# Altium project ExtendrjPcb.PrjPcb
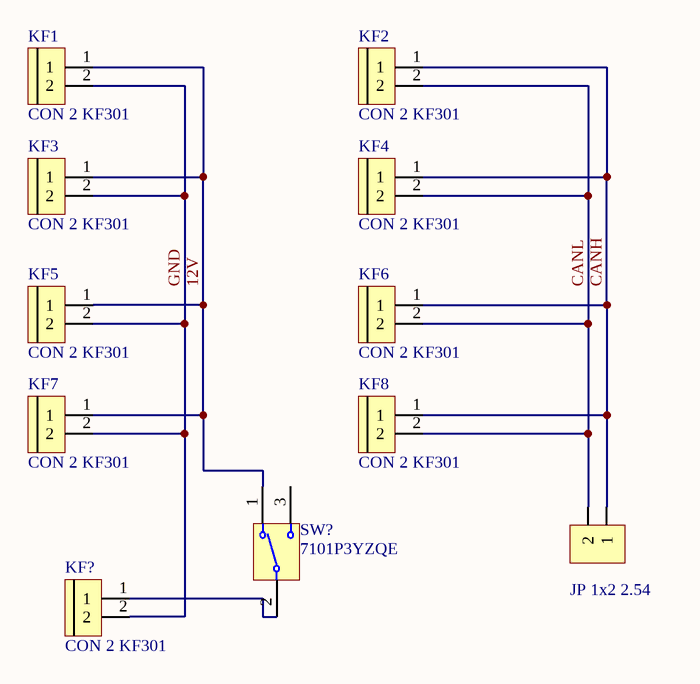
[diagram p0: Sheet2.SchDoc]
1 sheet, 11 parts. Net scope: global (net labels, ports and power ports of the same name join across sheets).
Board file: PCB2.PcbDoc

## Sheet Sheet2.SchDoc
size A; SheetNumber: 1; SheetTotal: 1

### Parts
JP1  JP 1x2 2.54  [JP 1x2 DT]
KF1  CON 2 KF301  [Con 2 KF301 5.08]
KF2  CON 2 KF301  [Con 2 KF301 5.08]
KF3  CON 2 KF301  [Con 2 KF301 5.08]
KF4  CON 2 KF301  [Con 2 KF301 5.08]
KF5  CON 2 KF301  [Con 2 KF301 5.08]
KF6  CON 2 KF301  [Con 2 KF301 5.08]
KF7  CON 2 KF301  [Con 2 KF301 5.08]
KF8  CON 2 KF301  [Con 2 KF301 5.08]
KF?  CON 2 KF301  [Con 2 KF301 5.08]
SW?  7101P3YZQE  [SW_TOGGLE_7101P3YZQE]

### Nets
12V: KF1.1 KF3.1 KF5.1 KF7.1 SW?.1(NC)
CANH: JP1.1 KF2.1 KF4.1 KF6.1 KF8.1
CANL: JP1.2 KF2.2 KF4.2 KF6.2 KF8.2
GND: KF1.2 KF3.2 KF5.2 KF7.2 KF?.2
NetKF?_1: KF?.1 SW?.2(COM)

Not connected (* = marked no-connect by the designer): SW? 3(NO)

### Library data of the parts
JP1 = JP 1x2 2.54 Duc Thang: Cắm; Ten_Linh_Kien: Jump Đơn Đực 2.54MM 1x40P Thẳng 11MM; Don_Vi: Con; Ma_Hang: MH000903; Ghi_Chu: *; Kieu_Chan: *; Chung_Loai: Cắm
KF1-KF8 KF? = CON 2 KF301: Cắm; Ma_Hang: MH000987; Ten_Linh_Kien: CON 2 KF301-2P 5.08MM Xanh Dương; Chung_Loai: Cắm; Ghi_Chu: *; Kieu_Chan: *; Don_Vi: Con
SW? = SW_TOGGLE_7101P3YZQE: SWITCH TOGGLE SPDT 5A 120V; Manufacturer: C&K; Switch Function: On-On; Current Rating: 5A (AC/DC); Voltage Rating - DC: 28V; Actuator Type: Flat Anti-Rotation; Actuator Length: 11.43mm; Illumination: Non-Illuminated; Actuator Material: Brass, Chrome Plated; Electrical Life: 100,000 Cycles; Supplier 1: Digi-Key; Manufacturer Part Number: 7101P3YZQE; RoHS: RoHS Compliant; Category: Switches; Stock 1: 933; Pricing 1: 1=6.11, 10=5.801, 25=5.648, 50=5.4954, 100=5.3428, 250=5.03744, 500=4.2742, 1000=4.04523 (USD); Packaging: Bulk; Part Status: Active; Circuit: SPDT; Voltage Rating - AC: 120V; Illumination Type, Color: -; Illumination Voltage (Nominal): -; Mounting Type: Panel Mount; Termination Style: Solder Lug; Panel Cutout Dimensions: Circular - 6.35mm Dia; Bushing Thread: 1/4-40; Ingress Protection: -; Features: Epoxy Sealed Terminals; Operating Temperature: -30°C ~ 85°C; ComponentLink1URL: http://www.ckswitches.com/media/1394/7000toggle.pdf; ComponentLink1Description: http://www.ckswitches.com/media/1394/7000toggle.pdf; Supplier Part Number 1: CKN1019-ND